# Altium project carl.PrjPcb
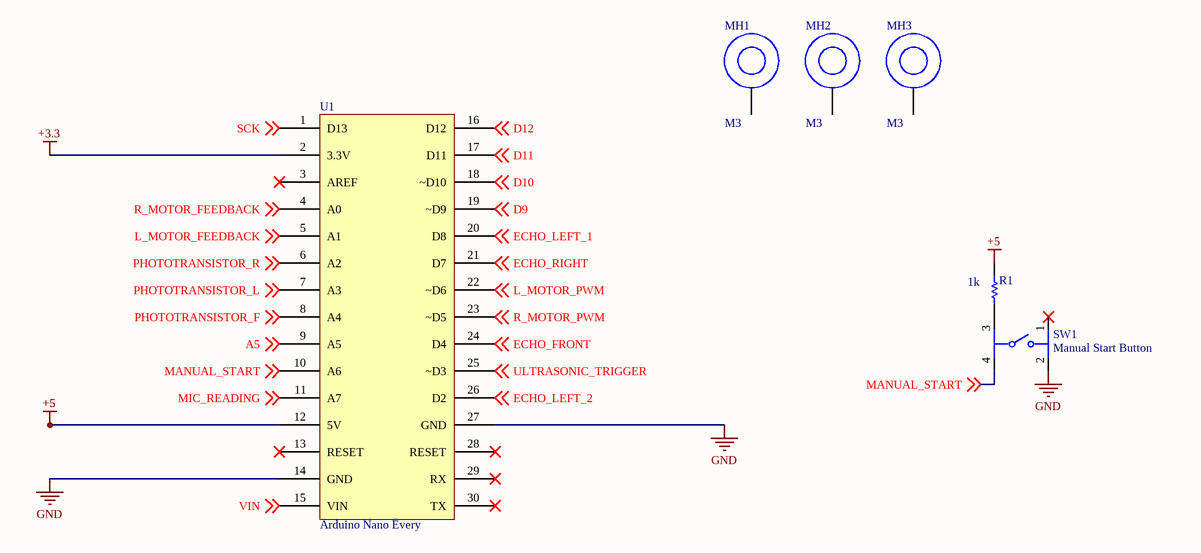
[diagram p0: ic.SchDoc]
4 sheets, 85 parts. Net scope: global (net labels, ports and power ports of the same name join across sheets).
Board file: 3400_PCB_V1.PcbDoc
Sheets:
  ic.SchDoc
  headers.SchDoc
  mic.SchDoc
  leds.SchDoc

## Sheet ic.SchDoc
size A; SheetNumber: 1; SheetTotal: 4

### Parts
MH1  M3  [PTH_M3]  (no BOM)
MH2  M3  [PTH_M3]  (no BOM)
MH3  M3  [PTH_M3]  (no BOM)
R1  1k  [RESC2013X50X30NL20T20]
SW1  Manual Start Button  [FP-PTS645SM43SMTR92LFS-MFG]
U1  Arduino Nano Every  [Arduino Nano]

### Nets
+3.3: U1.2(3.3V)
+5: R1.2 U1.12(5V)
GND: SW1.2 U1.14(GND) U1.27(GND)
A5: U1.9(A5) ; off-sheet A5
D9: U1.19(~D9) ; off-sheet D9
D10: U1.18(~D10) ; off-sheet D10
D11: U1.17(D11) ; off-sheet D11
D12: U1.16(D12) ; off-sheet D12
ECHO_FRONT: U1.24(D4) ; off-sheet ECHO_FRONT
ECHO_LEFT_1: U1.20(D8) ; off-sheet ECHO_LEFT_1
ECHO_LEFT_2: U1.26(D2) ; off-sheet ECHO_LEFT_2
ECHO_RIGHT: U1.21(D7) ; off-sheet ECHO_RIGHT
L_MOTOR_FEEDBACK: U1.5(A1) ; off-sheet L_MOTOR_FEEDBACK
L_MOTOR_PWM: U1.22(~D6) ; off-sheet L_MOTOR_PWM
MANUAL_START: SW1.4 U1.10(A6) ; off-sheet MANUAL_START
MIC_READING: U1.11(A7) ; off-sheet MIC_READING
PHOTOTRANSISTOR_F: U1.8(A4) ; off-sheet PHOTOTRANSISTOR_F
PHOTOTRANSISTOR_L: U1.7(A3) ; off-sheet PHOTOTRANSISTOR_L
PHOTOTRANSISTOR_R: U1.6(A2) ; off-sheet PHOTOTRANSISTOR_R
R_MOTOR_FEEDBACK: U1.4(A0) ; off-sheet R_MOTOR_FEEDBACK
R_MOTOR_PWM: U1.23(~D5) ; off-sheet R_MOTOR_PWM
SCK: U1.1(D13) ; off-sheet SCK
ULTRASONIC_TRIGGER: U1.25(~D3) ; off-sheet ULTRASONIC_TRIGGER
VIN: U1.15(VIN) ; off-sheet VIN
NetR1_1: R1.1 SW1.3

Not connected (* = marked no-connect by the designer): MH1 1; MH2 1; MH3 1; SW1 1*; U1 3(AREF)* 13(RESET)* 28(RESET)* 29(RX)* 30(TX)*

### Library data of the parts
MH1-MH3 = PTH: M3 Plated Through Hole; Value: M3
R1 = CMP-1013-00510-2: Part Number: CRCW08051K00FKEA; Manufacturer: Vishay Dale; MPN: CRCW08051K00FKEA
SW1 = CMP-2000-05160-2: SWITCH TACTILE SPST-NO 0.05A 12V; MPN: PTS645SM43SMTR92LFS; Contact Resistance: 100mR; Throw Configuration: SPST; Illumination Type: Non-Illuminated; Mechanical Life: 100000Cycles; Current Rating: 50mA; Switch Function: Off-Mom; Actuator Length: 0.85mm; Actuator Material: Nylon; Actuator Type: Standard; Operating Force: 160gf; Min Operating Temperature: -20°C; REACH SVHC: No SVHC; Termination: Gull Wing; Case/Package: SMD/SMT; Packaging: Tape and Reel; Mount: Surface Mount; Voltage Rating (DC): 12V; Orientation: Straight; Lead Free: Lead Free; Contact Material: Silver; Color: Black; Max Current Rating: 50mA; Contact Plating: Silver; Depth: 9mm; Package Quantity: 1; Max Voltage Rating (DC): 12V; Length: 6mm; Max Operating Temperature: 60°C
U1 = Arduino Mount

## Sheet headers.SchDoc
size A; SheetNumber: 2; SheetTotal: 4
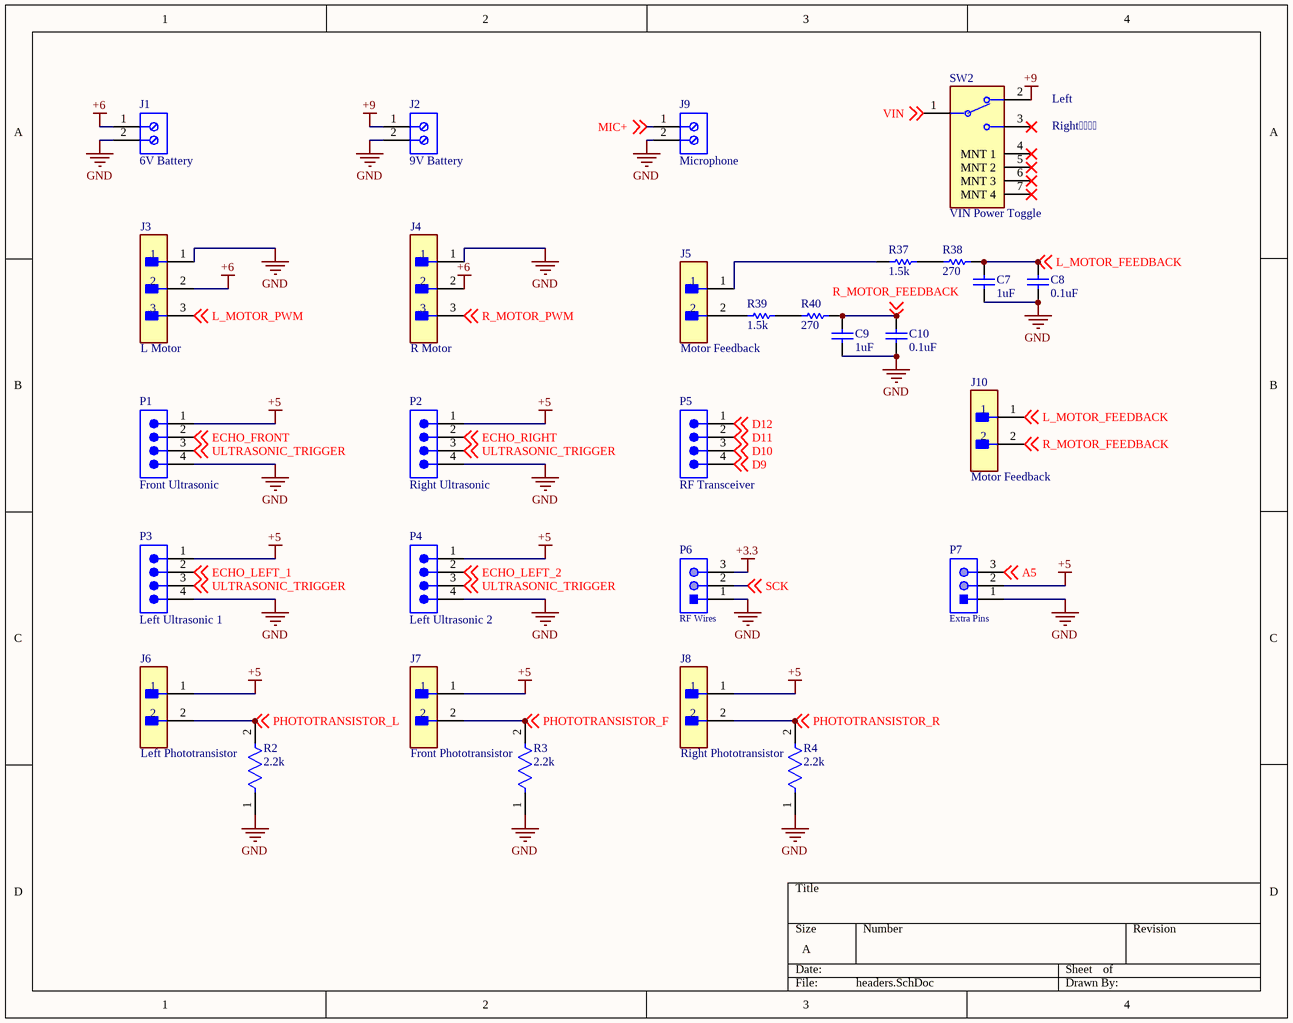
[diagram p1: headers.SchDoc]

### Parts
C7  1uF  [CAPC2013X145X50LL20T25]
C8  0.1uF  [CAPC2013X145X50LL20T25]
C9  1uF  [CAPC2013X145X50LL20T25]
C10  0.1uF  [CAPC2013X145X50LL20T25]
J1  6V Battery  [691103110002]
J2  9V Battery  [691103110002]
J3  L Motor  [FP-5-104935-3-MFG]
J4  R Motor  [FP-5-104935-3-MFG]
J5  Motor Feedback  [FP-M20-9990246-MFG]
J6  Left Phototransistor  [FP-M20-9990246-MFG]
J7  Front Phototransistor  [FP-M20-9990246-MFG]
J8  Right Phototransistor  [FP-M20-9990246-MFG]
J9  Microphone  [691103110002]
J10  Motor Feedback  [FP-M20-9990246-MFG]
P1  Front Ultrasonic  [SMTC-TSW-104-08-X-S]
P2  Right Ultrasonic  [SMTC-TSW-104-08-X-S]
P3  Left Ultrasonic 1  [SMTC-TSW-104-08-X-S]
P4  Left Ultrasonic 2  [SMTC-TSW-104-08-X-S]
P5  RF Transceiver  [SMTC-TSW-104-08-X-S]
P6  RF Wires  [61300311121]
P7  Extra Pins  [61300311121]
R2  2.2k  [FP-CRCW0805-e3-IPC_B]
R3  2.2k  [FP-CRCW0805-e3-IPC_B]
R4  2.2k  [FP-CRCW0805-e3-IPC_B]
R37  1.5k  [RESC1609X50X30NL8T20]
R38  270  [RESC1609X50X30NL8T20]
R39  1.5k  [RESC1609X50X30NL8T20]
R40  270  [RESC1609X50X30NL8T20]
SW2  VIN Power Toggle  [FP-PCM12SMTR-MFG]

### Nets
+3.3: P6.3
+5: J6.1 J7.1 J8.1 P1.1 P2.1 P3.1 P4.1 P7.2
+6: J1.1 J3.2 J4.2
+9: J2.1 SW2.2
GND: C7.1 C8.1 C9.2 C10.1 J1.2 J2.2 J3.1 J4.1 J9.2 P1.4 P2.4 P3.4 P4.4 P6.1 P7.1 R2.1 R3.1 R4.1
A5: P7.3 ; off-sheet A5
D9: P5.4 ; off-sheet D9
D10: P5.3 ; off-sheet D10
D11: P5.2 ; off-sheet D11
D12: P5.1 ; off-sheet D12
ECHO_FRONT: P1.2 ; off-sheet ECHO_FRONT
ECHO_LEFT_1: P3.2 ; off-sheet ECHO_LEFT_1
ECHO_LEFT_2: P4.2 ; off-sheet ECHO_LEFT_2
ECHO_RIGHT: P2.2 ; off-sheet ECHO_RIGHT
L_MOTOR_FEEDBACK: C7.2 C8.2 J10.1 R38.2 ; off-sheet L_MOTOR_FEEDBACK
L_MOTOR_PWM: J3.3 ; off-sheet L_MOTOR_PWM
MIC+: J9.1 ; off-sheet MIC+
PHOTOTRANSISTOR_F: J7.2 R3.2 ; off-sheet PHOTOTRANSISTOR_F
PHOTOTRANSISTOR_L: J6.2 R2.2 ; off-sheet PHOTOTRANSISTOR_L
PHOTOTRANSISTOR_R: J8.2 R4.2 ; off-sheet PHOTOTRANSISTOR_R
R_MOTOR_FEEDBACK: C9.1 C10.2 J10.2 R40.2 ; off-sheet R_MOTOR_FEEDBACK
R_MOTOR_PWM: J4.3 ; off-sheet R_MOTOR_PWM
SCK: P6.2 ; off-sheet SCK
ULTRASONIC_TRIGGER: P1.3 P2.3 P3.3 P4.3 ; off-sheet ULTRASONIC_TRIGGER
VIN: SW2.1 ; off-sheet VIN
NetJ5_1: J5.1 R37.1
NetJ5_2: J5.2 R39.1
NetR37_2: R37.2 R38.1
NetR39_2: R39.2 R40.1

Not connected (* = marked no-connect by the designer): SW2 3* 4(MNT_1)* 5(MNT_2)* 6(MNT_3)* 7(MNT_4)*

### Notes on the sheet
- (near SW2) Left
- (near SW2) Right

### Library data of the parts
C7-C10 = CMP-1036-04746-2: Manufacturer: Kemet; Part Number: C0805C105K4PACTU
J1 J2 J9 = CMP-1502-03254-1: Series 1031 - 3.50 mm Horizontal Entry Modular with Pressure Clamp WR-TBL, 2 pin; Manufacturer: Wurth Elektronik; Pin Number: 2; Pitch: 3.50mm; Datasheet URL: http://katalog.we-online.de/em/datasheet/6911031100xx.pdf; Package Reference: 691103110002; Publisher: WurthElektronik; Manufacturer URL: http://www.we-online.de; Mounting Technology: THT; Operating Temperature: -40to105degC; Part Number: 691103110002; Packaging: Box; MPN: 691103110002
J3 J4 = CMP-03369-000121-1: CONN HEADER R/A 3POS 2.54MM; MPN: 5-104935-3; Gender: Male; Contact Retention: Yes (With); Number of Contacts: 3; Max Voltage Rating (AC): 30V; Approvals: CSA; PCB Mount Alignment: No (Without); Tail Length: 3.3mm; Row Spacing: 0.1inch; PCB Thickness: 0.062inch; Insulation Resistance: 5GR; Current Rating: 3A; PCB Mount Retention: Without; Contact Resistance: 15mR; PCB Mounting Orientation: Right Angle; Connector Type: Plug; Orientation: Right Angle; Termination: Crimp; Mating Retention: Yes (With); Housing Material: Thermoplastic; Contact Mating Length: 0.23inch; Contact Gender: Male; Number of Rows: 1; Contact Material: Brass; Packaging: Rail/Tube; Flammability Rating: UL94 V-0; Contact Plating: Gold; Radiation Hardening: No; Contact Current Rating: 3A; RoHS Compliant: Yes; Height: 13.59mm; ELV: Compliant; Mount: Through Hole; Color: Black; Contact Type: Male Pin; Length: 0.4inch; Mating Alignment: Yes (With); Strain Relief: No (Without); Pitch: 2.54mm; Backwall/Post Interruptions: No (Without); Housing Color: Black; Contact Shape: Square; Depth: 13.59mm; Min Operating Temperature: -65°C; Series: AMPMODU MTE; Max Operating Temperature: 105°C; Number of Positions: 3; Lead Free: Lead Free; Package Quantity: 52
J5 J10 = CMP-15831-000009-1: CONN HEADER VERT 2POS 2.54MM; Manufacturer: Harwin; Manufacturer Part Number: M20-9990246; Conn Gender: Male; Conn Orientation: Vertical; Number Of Contacts: 2; Current Rating: 3A; ComponentLink2URL: https://cdn.harwin.com/pdfs/M20-999.pdf; ComponentLink2Description: Datasheet; Package: M20-9990246; Temperature: -40°C to +105°C; Octopart: https://octopart.com/m20-9990246-harwin-2590635; Mouser Description: 2.54mm (0.1") Pitch SIL Vertical PC Tail Pin Header, 6.1mm mating pin height, tin, 2 contacts; Temperature Range High: +105°C; Device Class L1: Connectors; RoHS: TRUE; Automotive: No; Height: 8.99mm; Number Of Rows: 1; Contact Material: Tin,Nickel; Category: Conn; Pitch: 2.54mm; Lead Free: Yes; Digikey Description: CONN HEADER VERT 2POS 2.54MM; Temperature Range Low: -40°C; Device Class L3: unset; Device Class L2: Headers and Wire Housings
J6-J8 = CMP-15831-000009-1: CONN HEADER VERT 2POS 2.54MM; Manufacturer: Harwin; Manufacturer Part Number: M20-9990246; Conn Gender: Male; Description: Connector Header Through Hole 2 position 0.100" (2.54mm); Conn Orientation: Vertical; Number Of Contacts: 2; Current Rating: 3A; ComponentLink2URL: https://cdn.harwin.com/pdfs/M20-999.pdf; ComponentLink2Description: Datasheet; Package: M20-9990246; Temperature: -40°C to +105°C; Octopart: https://octopart.com/m20-9990246-harwin-2590635; Mouser Description: 2.54mm (0.1") Pitch SIL Vertical PC Tail Pin Header, 6.1mm mating pin height, tin, 2 contacts; Temperature Range High: +105°C; Device Class L1: Connectors; RoHS: TRUE; Automotive: No; Height: 8.99mm; Number Of Rows: 1; Contact Material: Tin,Nickel; Category: Conn; Pitch: 2.54mm; Lead Free: Yes; Digikey Description: CONN HEADER VERT 2POS 2.54MM; Temperature Range Low: -40°C; Device Class L3: unset; Device Class L2: Headers and Wire Housings
P1-P5 = CMP-1024-00355-1: 0.025" SQ Post Header, Through-hole, Vertical, -55 to 125 degC, 2.54 mm Pitch, 4-Pin, Male, RoHS; Manufacturer: Samtec; PartNumber: TSW-104-08-F-S; Pitch: 2.54 mm; Temperature Range: -55 to 125 degC; ComponentLink3URL: http://www.samtec.com/documents/webfiles/cpdf/TSW-XXX-XX-XXX-X-XX-XXX-MKT.pdf; ComponentLink1Description: Manufacturer URL; PackageReference: TSW-104-08-X-S; DatasheetVersion: F-214; Mounting Technology: Through-hole; ComponentLink3Description: Package Specification; PackageVersion: DM, 8/1988; ComponentLink2Description: Datasheet; ComponentLink1URL: http://www.samtec.com; Orientation: Vertical; ComponentLink2URL: http://www.samtec.com/documents/webfiles/pdf/TSW_TH.PDF; RoHS: True; PackageDescription: .025[0.64] SQ. Post Terminal Strip Assembly
P6 P7 = CMP-1502-01062-1: THT Vertical Pin Header WR-PHD, Pitch 2.54 mm, Single Row, 3 pins; Manufacturer: Wurth Elektronik; Withstanding Voltage: 500VAC; Working Voltage: 250VAC; Rated Current: 3A; Pitch: 2.54mm; Pin Number: 3; Gender: Male; Contact Resistance: 20mOhm; Package Reference: 61300311121; Manufacturer URL: http://www.we-online.de; Datasheet URL: https://katalog.we-online.de/em/datasheet/6130xx11121.pdf; Operating Temperature: -40to105degC; Part Number: 61300311121; Orientation: Vertical; Packaging: Bag; Row Number: Single; Mounting Technology: THT; Publisher: WurthElektronik
R2-R4 = CMP-2001-03760-2: RES Thick Film, 2.2kΩ, 1%, 0.125W, 100ppm/°C, 0805; MPN: CRCW08052K20FKEA; Voltage Rating (DC): 150V; Max Power Dissipation: 125mW; Resistance: 2.2kR; Case/Package: 0805; Width: 1.25mm; Voltage Rating: 150V; Composition: Thick Film; Power Rating: 125mW; Packaging: Tape and Reel; Min Operating Temperature: -55°C; Contact Plating: Tin; Tolerance: 1%; Military Standard: Not; Case Code (Metric): 2012; Radiation Hardening: No; Termination: SMD/SMT; Lead Free: Lead Free; Case Code (Imperial): 0805; Max Operating Temperature: 155°C; Depth: 1.25mm; Weight: 0.000194oz; Number of Terminations: 2; Length: 2mm; Package Quantity: 10; Temperature Coefficient: 100ppm/°C; Features: Automotive AEC-Q200; Height: 0.45mm
R37-R40 = CMP-1666-00005-4: Chip Resistor, 10 KOhm, +/- 1%, 100 mW, -55 to 155 degC, 0603 (1608 Metric), RoHS, Tape and Reel; Manufacturer: Vishay Semiconductor; Voltage Rating: 75 V; Max Operating Temperature: 155 degC; PackageDescription: 2-Pin Surface Mount Device, Body 1.575 x 0.85 mm; ComponentLink1Description: Manufacturer URL; RoHSCompliant: true; PackageReference: 0603; REACH SVHC: Unknown; Length: 1.55 mm; DatasheetVersion: 06/2012; Packaging: Tape and Reel; Min Operating Temperature: -55 degC; Mounting Technology: Surface Mount; ComponentLink2URL: https://datasheet.ciiva.com/11809/0900766b80d98afc-11809037.pdf; Height: 0.45 mm; ComponentLink2Description: Datasheet; Package Quantity: 5000; ComponentLink1URL: http://www.vishay.com/
SW2 = CMP-2000-06884-2: SWITCH SLIDE SPDT 300MA 6V; MPN: PCM12SMTR; Actuator Material: Nylon; Switch Function: On-On; Insulation Resistance: 100mR; Actuator Type: Standard; Mechanical Life: 10000Cycles; Actuator Length: 1.5mm; Contact Resistance: 70mR; Min Operating Temperature: -20°C; Max Current Rating: 300mA; Max Voltage Rating (DC): 6V; Package Quantity: 1; Mount: Surface Mount; Packaging: Tape and Reel; Contact Plating: Silver; Depth: 5mm; REACH SVHC: No SVHC; Voltage Rating (DC): 6V; Voltage Rating (AC): 6V; Max Operating Temperature: 85°C; Length: 7.7mm; Termination: Gull Wing; Current Rating: 300mA; Contact Current Rating: 300mA; Orientation: Right Angle; Width: 6.7mm; Switch Travel: 1.5mm; Lead Free: Lead Free; Contact Material: Copper Alloy; Throw Configuration: SPDT

## Sheet mic.SchDoc
size A; SheetNumber: 3; SheetTotal: 4
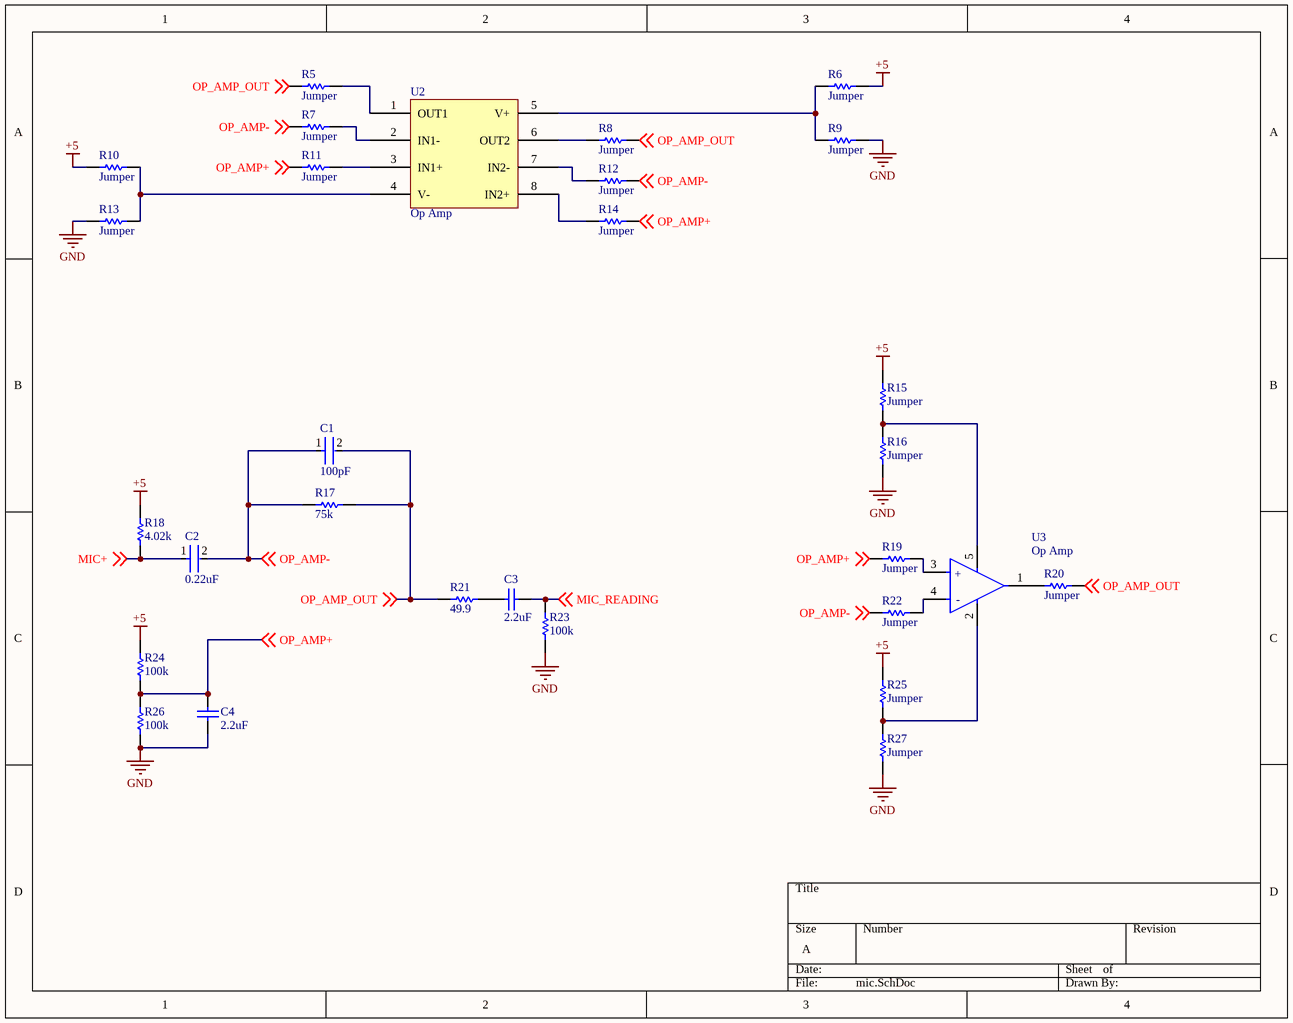
[diagram p2: mic.SchDoc]

### Parts
C1  100pF  [FP-C0805C-DN-MFG]
C2  0.22uF  [FP-C0805C-DN-MFG]
C3  2.2uF  [CAPC2113X140X50LL30T25]
C4  2.2uF  [CAPC2113X140X50LL30T25]
R5  Jumper  [RESC2013X70X40NL20T20]
R6  Jumper  [RESC2013X70X40NL20T20]
R7  Jumper  [RESC2013X70X40NL20T20]
R8  Jumper  [RESC2013X70X40NL20T20]
R9  Jumper  [RESC2013X70X40NL20T20]
R10  Jumper  [RESC2013X70X40NL20T20]
R11  Jumper  [RESC2013X70X40NL20T20]
R12  Jumper  [RESC2013X70X40NL20T20]
R13  Jumper  [RESC2013X70X40NL20T20]
R14  Jumper  [RESC2013X70X40NL20T20]
R15  Jumper  [RESC2013X70X40NL20T20]
R16  Jumper  [RESC2013X70X40NL20T20]
R17  75k  [RESC2013X70X40NL20T20]
R18  4.02k  [RESC2013X70X40NL20T20]
R19  Jumper  [RESC2013X70X40NL20T20]
R20  Jumper  [RESC2013X70X40NL20T20]
R21  49.9  [RESC2013X70X40NL20T20]
R22  Jumper  [RESC2013X70X40NL20T20]
R23  100k  [RESC2013X70X40ML20T20]
R24  100k  [RESC2013X70X40ML20T20]
R25  Jumper  [RESC2013X70X40NL20T20]
R26  100k  [RESC2013X70X40ML20T20]
R27  Jumper  [RESC2013X70X40NL20T20]
U2  Op Amp  [Op Amp]
U3  Op Amp  [FP-DBV0005A-MFG]

### Nets
+5: R6.2 R10.1 R15.1 R18.2 R24.2 R25.1
GND: C4.1 R9.2 R13.1 R16.2 R23.1 R26.1 R27.2
MIC+: C2.1 R18.1 ; off-sheet MIC+
MIC_READING: C3.1 R23.2 ; off-sheet MIC_READING
OP_AMP+: C4.2 R11.1 R14.2 R19.1 R24.1 R26.2 ; off-sheet OP_AMP+
OP_AMP-: C1.1 C2.2 R7.1 R12.2 R17.2 R22.1 ; off-sheet OP_AMP-
OP_AMP_OUT: C1.2 R5.1 R8.2 R17.1 R20.2 R21.2 ; off-sheet OP_AMP_OUT
NetC3_2: C3.2 R21.1
NetR5_2: R5.2 U2.1(OUT1)
NetR6_1: R6.1 R9.1 U2.5(V+)
NetR7_2: R7.2 U2.2(IN1-)
NetR8_1: R8.1 U2.6(OUT2)
NetR10_2: R10.2 R13.2 U2.4(V-)
NetR11_2: R11.2 U2.3(IN1+)
NetR12_1: R12.1 U2.7(IN2-)
NetR14_1: R14.1 U2.8(IN2+)
NetR15_2: R15.2 R16.1 U3.5(V+)
NetR19_2: R19.2 U3.3(+IN)
NetR20_1: R20.1 U3.1(OUT)
NetR22_2: R22.2 U3.4(-IN)
NetR25_2: R25.2 R27.1 U3.2(V-)

### Notes on the sheet
- (in symbol CMP-04893-000008-1) +; -

### Library data of the parts
C1 = CMP-03020-013647-1: CAP CER 100PF 50V C0G/NP0 0805; Manufacturer Part Number: C0805C101J5GACTU; Manufacturer: KEMET; Temperature Characteristic: C0G; Description: C0805 100 pF C0G 30ppm/°C 5.00% 50 V; Tolerance: 0.05; Material: Ceramic; Temperature Coefficient: 30ppm/°C; Temperature Range High: +125°C; Voltage Rating: 50 V; Device Class L1: Passive Components; Category: Cap; Capacitance: 100 pF; Temperature Range Low: -55°C; Height: 0.88mm; Package: C0805C-DN; Device Class L2: Capacitors; Octopart: https://octopart.com/c0805c101j5gactu-kemet-100795; Ipc Land Pattern Name: CAPC200125X78; Value: 100 pF; RoHS: TRUE; Temperature: -55°C to +125°C; Lead Free: Yes; Automotive: No; ComponentLink2URL: https://content.kemet.com/datasheets/KEM_C1003_C0G_SMD.pdf; ComponentLink2Description: Datasheet; Digikey Description: CAP CER 100PF 50V C0G/NP0 0805; Device Class L3: Ceramic Capacitors; MPN: C0805C101J5GACTU
C2 = CMP-1036-04552-2: CAP CER 0.22UF 50V X7R 0805; Manufacturer: KEMET; Manufacturer Part Number: C0805C224K5RACTU; Value: 0.22 μF; Description: C0805 0.22 μF X7R 30ppm/°C 10.00% 50 V; Temperature Coefficient: 30ppm/°C; Material: Ceramic; Tolerance: 0.1; ComponentLink2URL: https://content.kemet.com/datasheets/KEM_C1003_C0G_SMD.pdf; Temperature Characteristic: X7R; Device Class L3: Ceramic Capacitors; Lead Free: Yes; Temperature: -55°C to +125°C; RoHS: TRUE; Capacitance: 0.22 μF; Automotive: No; Octopart: https://octopart.com/c0805c224k5ractu-kemet-144670; Temperature Range Low: -55°C; Height: 0.88mm; Device Class L1: Passive Components; Digikey Description: CAP CER 0.22UF 50V X7R 0805; ComponentLink2Description: Datasheet; Mouser Description: CAP CER 0.22UF 50V X7R 0805; Category: Cap; Ipc Land Pattern Name: CAPC200125X78; Temperature Range High: +125°C; Package: C0805C-DN; Device Class L2: Capacitors; Voltage Rating: 50 V; MPN: C0805C224K5RACTU
C3 C4 = CMP-2007-00007-1: Part Number: C0805C225K8RACTU; Manufacturer: Kemet; MPN: C0805C225K8RACTU
R5-R16 R19 R20 R22 R25 R27 = CMP-1665-00002-5: Chip Resistor, 0 Ohm, +/- 1%, 0.125 W, -55 to 155 degC, 0805 (2012 Metric), RoHS, Tape and Reel; PartNumber: ERJ-6GEY0R00V; Tolerance: 5%; Resistance: 0 Ohm; REACH SVHC: No SVHC; Min Operating Temperature: -55 degC; Case/Package: 0805; Packaging: Tape and Reel; Package Quantity: 5000; ComponentLink1Description: Manufacturer URL; PackageDescription: 2-Pin Surface Mount Device, Body 2 x 1.25 mm; Mounting Technology: Surface Mount; Max Operating Temperature: 155 degC; Width: 1.25 mm; RoHSCompliant: True; Height: 0.6 mm; ComponentLink1URL: http://www.panasonic.com/; ComponentLink2URL: http://industrial.panasonic.com/cdbs/www-data/pdf/RDA0000/AOA0000C84.pdf; Case Code (Imperial): 0805; DatasheetVersion: 03/2015; Length: 2 mm; Case Code (Metric): 2012; ComponentLink2Description: Datasheet; Radiation Hardening: No; MPN: ERJ-6GEY0R00V
R17 = CMP-2001-00290-1: Part Number: ERJ-6ENF7502V; Manufacturer: Panasonic; MPN: ERJ-6ENF7502V
R18 = CMP-2001-00168-1: Part Number: ERJ-6ENF4021V; Manufacturer: Panasonic; MPN: ERJ-6ENF4021V
R21 = CMP-2001-00215-1: Part Number: ERJ-6ENF49R9V; Manufacturer: Panasonic; MPN: ERJ-6ENF49R9V
R23 R24 R26 = CMP-2001-04377-1: Part Number: ERJ-6ENF1003V; Manufacturer: Panasonic; MPN: ERJ-6ENF1003V
U3 = CMP-04893-000008-1: IC OPAMP GP 1 CIRCUIT SOT23-5; MPN: OPA172IDBVT; Gain Bandwidth Product: 10MHz; Max Supply Voltage: 36V; Number of Circuits: 1; Max Dual Supply Voltage: 18V; Operating Supply Current: 1.6mA; Output Current per Channel: 75mA; Min Dual Supply Voltage: 2.25V; Common Mode Rejection Ratio: 90dB; Voltage Gain: 130dB; Input Bias Current: 8pA; Slew Rate: 10V/µs; Min Supply Voltage: 4.5V; Input Offset Voltage (Vos): 200uV; Packaging: Cut Tape; Max Operating Temperature: 125°C; Number of Channels: 1; RoHS Compliant: Yes; REACH SVHC: No SVHC; Number of Amplifiers: 1; Lead Free: Lead Free; Number of Pins: 5; Mount: Surface Mount; Case/Package: SOT-23-5; Min Operating Temperature: -40°C; Bandwidth: 10MHz

## Sheet leds.SchDoc
size A; SheetNumber: 4; SheetTotal: 4
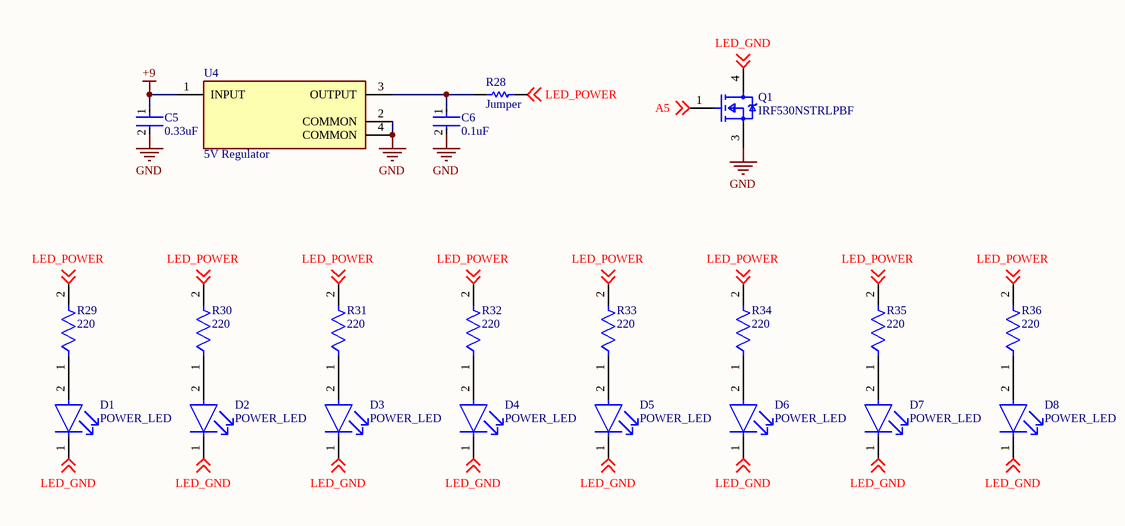
[diagram p3: leds.SchDoc]

### Parts
C5  0.33uF  [FP-C0805C-DN-MFG]
C6  0.1uF  [FP-C0805C-DN-MFG]
D1  POWER_LED  [FP-APTD3216CGCK-MFG]
D2  POWER_LED  [FP-APTD3216CGCK-MFG]
D3  POWER_LED  [FP-APTD3216CGCK-MFG]
D4  POWER_LED  [FP-APTD3216CGCK-MFG]
D5  POWER_LED  [FP-APTD3216CGCK-MFG]
D6  POWER_LED  [FP-APTD3216CGCK-MFG]
D7  POWER_LED  [FP-APTD3216CGCK-MFG]
D8  POWER_LED  [FP-APTD3216CGCK-MFG]
Q1  IRF530NSTRLPBF  [FP-PG-TO263-3-MFG]
R28  Jumper  [RESC2013X70X40NL20T20]
R29  220  [FP-CRCW0805-e3-MFG]
R30  220  [FP-CRCW0805-e3-MFG]
R31  220  [FP-CRCW0805-e3-MFG]
R32  220  [FP-CRCW0805-e3-MFG]
R33  220  [FP-CRCW0805-e3-MFG]
R34  220  [FP-CRCW0805-e3-MFG]
R35  220  [FP-CRCW0805-e3-MFG]
R36  220  [FP-CRCW0805-e3-MFG]
U4  5V Regulator  [FP-KTT0003A-MFG]

### Nets
+9: C5.1 U4.1(INPUT)
GND: C5.2 C6.2 Q1.3(S) U4.2(COMMON) U4.4(COMMON)
A5: Q1.1(G) ; off-sheet A5
LED_GND: D1.1(C) D2.1(C) D3.1(C) D4.1(C) D5.1(C) D6.1(C) D7.1(C) D8.1(C) Q1.4(D) ; off-sheet LED_GND
LED_POWER: R28.2 R29.2 R30.2 R31.2 R32.2 R33.2 R34.2 R35.2 R36.2 ; off-sheet LED_POWER
NetC6_1: C6.1 R28.1 U4.3(OUTPUT)
NetD1_2: D1.2(A) R29.1
NetD2_2: D2.2(A) R30.1
NetD3_2: D3.2(A) R31.1
NetD4_2: D4.2(A) R32.1
NetD5_2: D5.2(A) R33.1
NetD6_2: D6.2(A) R34.1
NetD7_2: D7.2(A) R35.1
NetD8_2: D8.2(A) R36.1

### Library data of the parts
C5 = CMP-1036-04607-3: CAP CER 0.33UF 50V X7R 0805; Manufacturer Part Number: C0805C334K5RACTU; Manufacturer: KEMET; Temperature Coefficient: 30ppm/°C; Value: 0.33 μF; Material: Ceramic; Description: C0805 0.33 μF X7R 30ppm/°C 10.00% 50 V; Tolerance: 0.1; Temperature: -55°C to +125°C; Temperature Range Low: -55°C; Voltage Rating: 50 V; Lead Free: Yes; Mouser Description: Multilayer Ceramic Capacitors MLCC - SMD/SMT 50volts 0.33uF 10% X7R; Automotive: No; Package: C0805C-DN; Temperature Characteristic: X7R; Capacitance: 0.33 μF; Digikey Description: CAP CER 0.33UF 50V X7R 0805; Device Class L3: Ceramic Capacitors; Temperature Range High: +125°C; Category: Cap; Ipc Land Pattern Name: CAPC200125X78; ComponentLink2URL: https://content.kemet.com/datasheets/KEM_C1003_C0G_SMD.pdf; ComponentLink2Description: Datasheet; RoHS: TRUE; Device Class L1: Passive Components; Height: 0.88mm; Octopart: https://octopart.com/c0805c334k5ractu-kemet-10475704; Device Class L2: Capacitors; MPN: C0805C334K5RACTU
C6 = CMP-2007-00279-2: CAP CER 0.1UF 50V X7R 0805; Manufacturer Part Number: C0805C104K5RACTU; Manufacturer: KEMET; Value: 0.10 μF; Description: C0805 0.10 μF X7R 30ppm/°C 10.00% 50 V; Tolerance: 0.1; Temperature Coefficient: 30ppm/°C; Material: Ceramic; Device Class L2: Capacitors; Temperature Range Low: -55°C; Voltage Rating: 50 V; Digikey Description: CAP CER 0.1UF 50V X7R 0805; Category: Cap; ComponentLink2Description: Datasheet; Octopart: https://octopart.com/c0805c104k5ractu-kemet-143926; RoHS: TRUE; ComponentLink2URL: https://content.kemet.com/datasheets/KEM_C1003_C0G_SMD.pdf; Temperature Characteristic: X7R; Temperature: -55°C to +125°C; Height: 0.88mm; Temperature Range High: +125°C; Device Class L1: Passive Components; Automotive: No; Lead Free: Yes; Ipc Land Pattern Name: CAPC200125X78; Device Class L3: Ceramic Capacitors; Mouser Description: Cap Ceramic 0.1uF 50V X7R 10% SMD 2.0 x 1.2 mm 125 C Paper T/R; Capacitance: 0.10 μF; Package: C0805C-DN; MPN: C0805C104K5RACTU
D1-D8 = CMP-2000-05792-2: LED GREEN CLEAR 2SMD; MPN: APTD3216CGCK; Forward Voltage: 2.1V; Forward Current: 20mA; Luminous Intensity: 300mcd; Number of LEDs: 1; Dominant Wavelength: 570nm; Viewing Angle: 50°; Value: Green LED; Lead Free: Lead Free; Lens Color: Clear; Mount: Surface Mount; Package Quantity: 2000; Height: 1.8mm; Number of Pins: 2; Test Current: 20mA; Case Code (Metric): 3216; Case/Package: 1206; Case Code (Imperial): 1206; Illumination Color: Green; Color: Green; Width: 1.6mm; Packaging: Tape and Reel; Min Operating Temperature: -40°C; Lens Style: Clear; Max Operating Temperature: 85°C; Length: 3.2mm; Parameter 2: *
Q1 = CMP-32901-000039-1: MOSFET N-CH 100V 17A D2PAK; Manufacturer: Infineon; Reverse Recovery Time: 93ns; Turn On Delay Time: 9.2ns; Number Of Channels: 1; Gate Charge At Vgs: 37nC @ 10V; Max Junction Temp: +175°C; Drain To Source Resistance: 90mΩ; Pulse Drain Current: 60A; Max Forward Diode Voltage: 1.3V; Threshold Vgs Min: 2V; Threshold Vgs Max: 4V; Depletion Mode: False; Rthja Max: 40°C/W; Reverse Recovery Charge: 320nC; Turn Off Delay Time: 35ns; Gate To Source Voltage: 20V; Power Dissipation: 3.8W; Standoff Height: 0mm; Input Capacitace At Vds: 920pF @ 25V; Height: 5.084mm; RoHS: TRUE; Device Class L2: Transistors; Lead Free: Yes; Automotive: No; Category: Trans; Footprint Url: https://www.infineon.com/cms/en/product/packages/PG-TO263/PG-TO263-3-901/; ComponentLink2Description: Datasheet; Temperature Range Low: -55°C; Drain To Source Voltage: 100V; Temperature: -55°C to +175°C; Device Class L1: Discrete Semiconductors; Number Of N Channels: 1; Continuous Drain Current: 17A; Temperature Range High: +175°C; Digikey Description: MOSFET N-CH 100V 17A D2PAK; Drain To Source Breakdown Voltage: 100V; ComponentLink2URL: https://www.infineon.com/dgdl/irf530nspbf.pdf?fileId=5546d462533600a4015355e38eb4199c; Manufacturer Part Number: IRF530NSTRLPBF; Device Class L3: MOSFETs; Octopart: https://octopart.com/irf530nstrlpbf-infineon-65873402; Package: PG-TO263-3
R28 = CMP-1665-00002-5: as R5 on sheet mic; REACH SVHC: No SVHC; Min Operating Temperature: -55 degC; Case/Package: 0805; Packaging: Tape and Reel; Package Quantity: 5000; ComponentLink1Description: Manufacturer URL; PackageDescription: 2-Pin Surface Mount Device, Body 2 x 1.25 mm; Mounting Technology: Surface Mount; Max Operating Temperature: 155 degC; Width: 1.25 mm; RoHSCompliant: True; Height: 0.6 mm; ComponentLink1URL: http://www.panasonic.com/; ComponentLink2URL: http://industrial.panasonic.com/cdbs/www-data/pdf/RDA0000/AOA0000C84.pdf; Case Code (Imperial): 0805; DatasheetVersion: 03/2015; Length: 2 mm; Case Code (Metric): 2012; ComponentLink2Description: Datasheet; Radiation Hardening: No; MPN: ERJ-6GEY0R00V
R29-R36 = CMP-2001-03682-2: RES Thick Film, 220Ω, 1%, 0.125W, 100ppm/°C, 0805; MPN: CRCW0805220RFKEA; Max Power Dissipation: 125mW; Voltage Rating: 150V; Resistance: 220R; Packaging: Tape and Reel; Termination: SMD/SMT; Height: 0.45mm; Package Quantity: 10; Width: 0.049inch; Min Operating Temperature: -55°C; Lead Free: Lead Free; Military Standard: Not; Mount: Surface Mount; Max Operating Temperature: 155°C; Voltage Rating (DC): 150V; Composition: Thick Film; Case/Package: 0805; Length: 2mm; Weight: 0.000194oz; Case Code (Metric): 2012; Number of Terminations: 2; Case Code (Imperial): 0805; Radiation Hardening: No; Tolerance: 1%; Features: Automotive AEC-Q200; Power Rating: 125mW; Depth: 1.25mm; Contact Plating: Tin; Temperature Coefficient: 100ppm/°C
U4 = CMP-1685-00014-2: IC REG LIN 5V 1.5A DDPAK/TO263-3; MPN: UA7805CKTTR; Output Type: Fixed; Quiescent Current: 8mA; Dropout Voltage: 2V; Max Input Voltage: 25V; Number of Regulators: 1; Max Output Voltage: 5.2V; Polarity: Positive; Min Output Voltage: 4.8V; Power Supply Rejection Ratio (PSRR): 78dB; Min Input Voltage: 7V; Power Rating: 15W; Number of Pins: 3; Output Voltage: 5V; Max Output Current: 1.5A; Nominal Output Voltage: 5V; Case/Package: TO-263; Width: 9.65mm; REACH SVHC: No SVHC; Max Operating Temperature: 125°C; Output Current: 1.5A; Weight: 0.050897oz; Contact Plating: Tin; Packaging: Tape and Reel; Mount: Surface Mount; Radiation Hardening: No; Lead Free: Lead Free; Min Operating Temperature: 0°C; Length: 10.67mm; Package Quantity: 1; Number of Outputs: 1; Height: 4.83mm

## Nets that join several sheets
+3.3: ic (U1.2), headers (P6.3)
+5: ic (R1.2 U1.12), headers (8 pins), mic (6 pins)
+9: headers (J2.1 SW2.2), leds (C5.1 U4.1)
GND: ic (SW1.2 U1.14 U1.27), headers (18 pins), mic (7 pins), leds (5 pins)
A5: ic (U1.9), headers (P7.3), leds (Q1.1)
D9: ic (U1.19), headers (P5.4)
D10: ic (U1.18), headers (P5.3)
D11: ic (U1.17), headers (P5.2)
D12: ic (U1.16), headers (P5.1)
ECHO_FRONT: ic (U1.24), headers (P1.2)
ECHO_LEFT_1: ic (U1.20), headers (P3.2)
ECHO_LEFT_2: ic (U1.26), headers (P4.2)
ECHO_RIGHT: ic (U1.21), headers (P2.2)
L_MOTOR_FEEDBACK: ic (U1.5), headers (C7.2 C8.2 J10.1 R38.2)
L_MOTOR_PWM: ic (U1.22), headers (J3.3)
MIC+: headers (J9.1), mic (C2.1 R18.1)
MIC_READING: ic (U1.11), mic (C3.1 R23.2)
PHOTOTRANSISTOR_F: ic (U1.8), headers (J7.2 R3.2)
PHOTOTRANSISTOR_L: ic (U1.7), headers (J6.2 R2.2)
PHOTOTRANSISTOR_R: ic (U1.6), headers (J8.2 R4.2)
R_MOTOR_FEEDBACK: ic (U1.4), headers (C9.1 C10.2 J10.2 R40.2)
R_MOTOR_PWM: ic (U1.23), headers (J4.3)
SCK: ic (U1.1), headers (P6.2)
ULTRASONIC_TRIGGER: ic (U1.25), headers (P1.3 P2.3 P3.3 P4.3)
VIN: ic (U1.15), headers (SW2.1)